# EAGLE design TeslaBMS_Shield_5 (EAGLE 6.6.0)
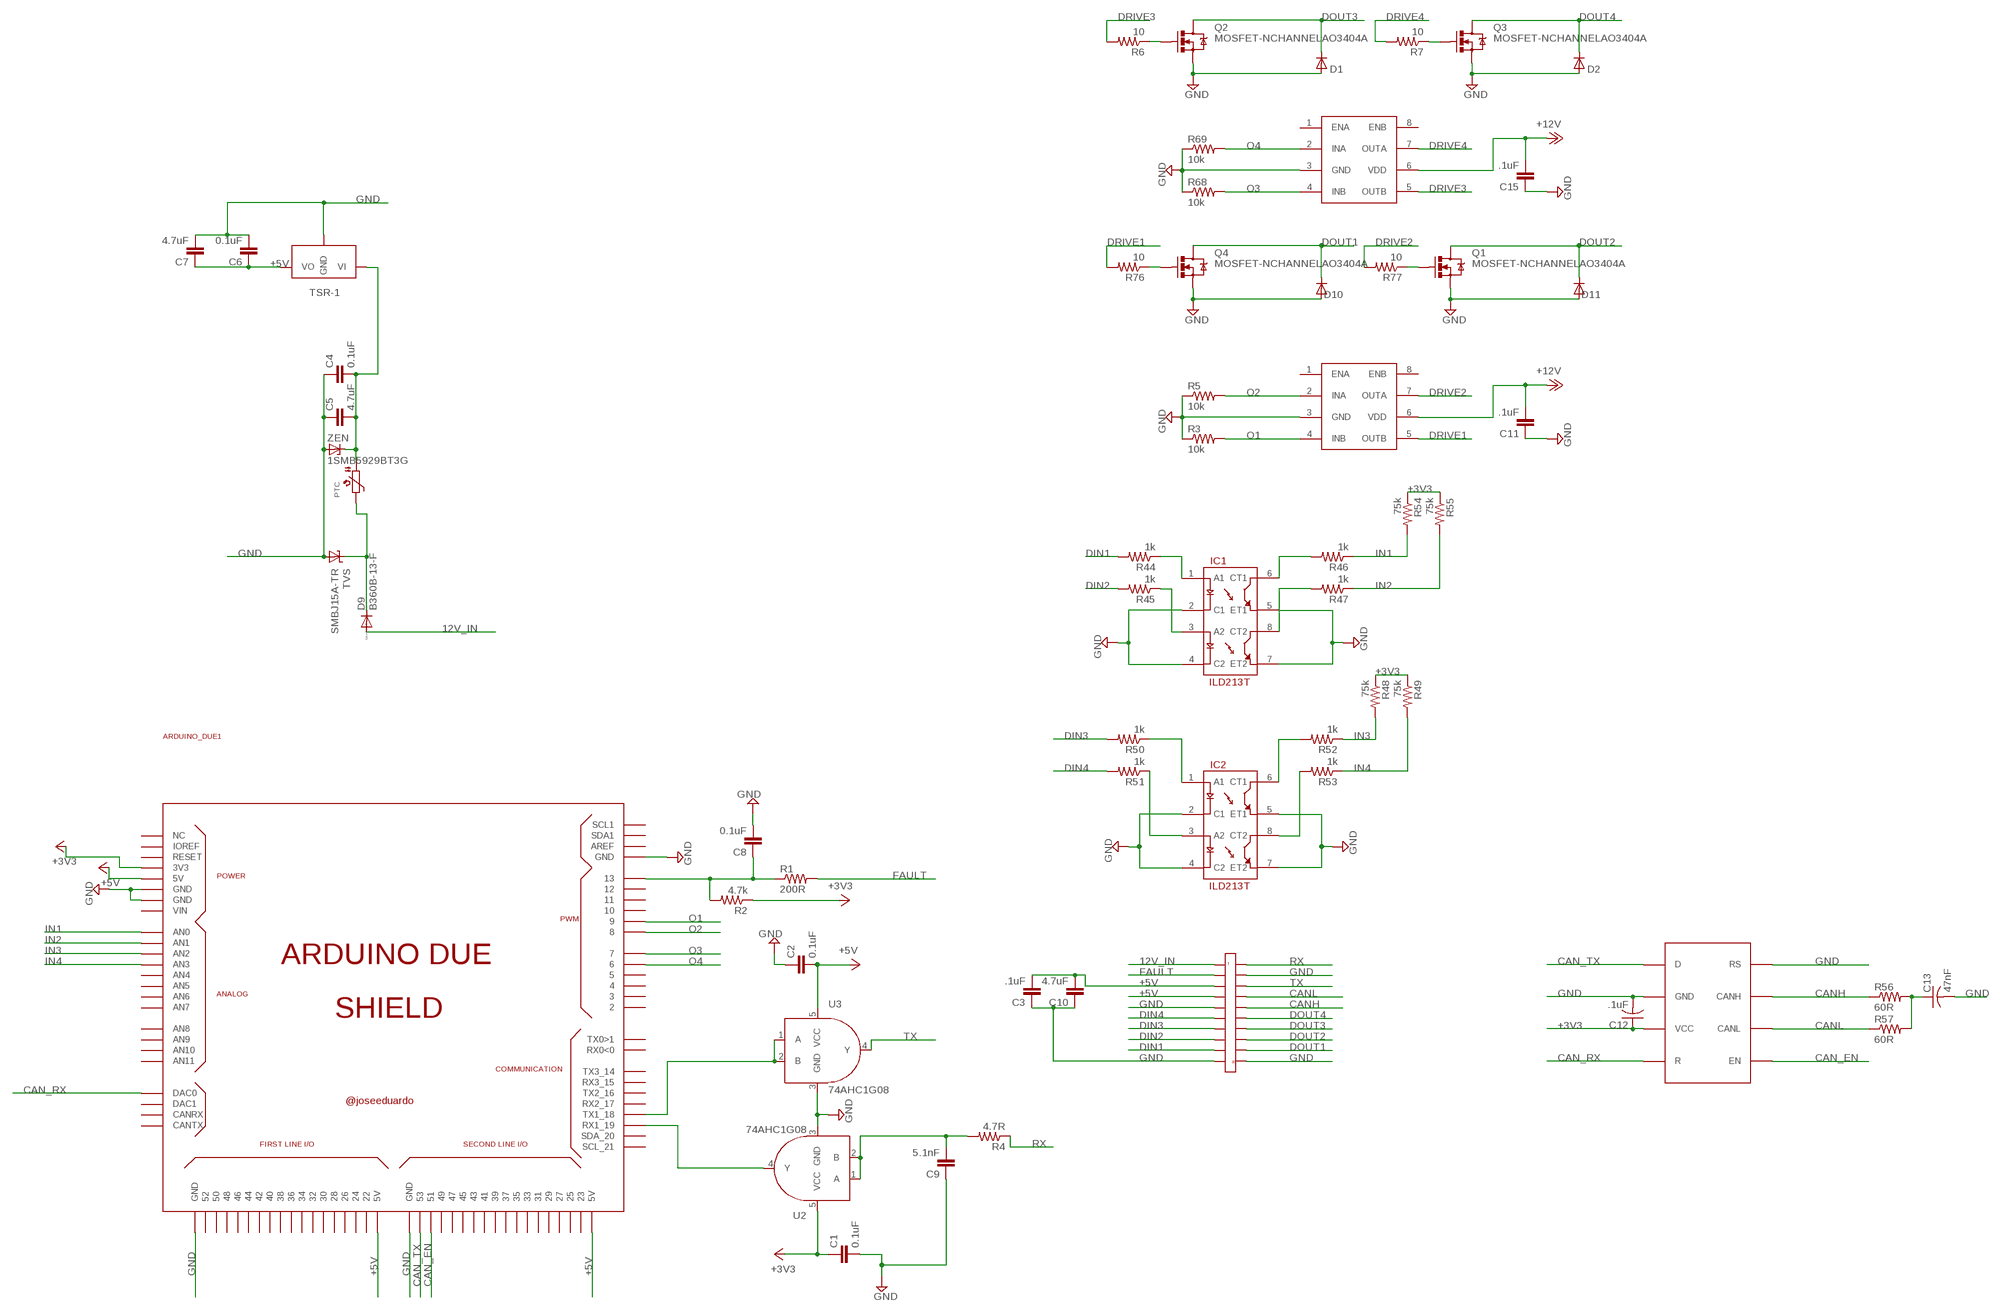
[diagram p0: schematic, sheet 1]

## Parts
ARDUINO_DUE1  ARDUINO_DUE_SHIELD  [ARDUINO_DUE_SHIELD]
C1  0.1uF  CAP0603-CAP  [0603-CAP]
C2  0.1uF  CAP0603-CAP  [0603-CAP]
C3  .1uF  CAP0603-CAP  [0603-CAP]
C4  0.1uF  CAP0805  [0805]
C5  4.7uF  CAP0805  [0805]
C6  0.1uF  CAP0805  [0805]
C7  4.7uF  CAP0805  [0805]
C8  0.1uF  CAP0603-CAP  [0603-CAP]
C9  5.1nF  CAP0603-CAP  [0603-CAP]
C10  4.7uF  CAP0603-CAP  [0603-CAP]
C11  .1uF  CAP0603-CAP  [0603-CAP]
C12  .1uF  C-USC0603  [C0603]
C13  47nF  C-USC0805  [C0805]
C15  .1uF  CAP0603-CAP  [0603-CAP]
D1  MBR0520LT  [SOD123]
D2  MBR0520LT  [SOD123]
D9  B360B-13-F  DIODE-SMB  [SMB]
D10  MBR0520LT  [SOD123]
D11  MBR0520LT  [SOD123]
IC1  ILD213T  [SO08]
IC2  ILD213T  [SO08]
PTC  PTC1812  [PTC1812]
Q1  MOSFET-NCHANNELAO3404A  [SOT23-3]
Q2  MOSFET-NCHANNELAO3404A  [SOT23-3]
Q3  MOSFET-NCHANNELAO3404A  [SOT23-3]
Q4  MOSFET-NCHANNELAO3404A  [SOT23-3]
R1  200R  RESISTOR0603-RES  [0603-RES]
R2  4.7k  RESISTOR0603-RES  [0603-RES]
R3  10k  R-US_R0402  [R0402]
R4  4.7R  RESISTOR0603-RES  [0603-RES]
R5  10k  R-US_R0402  [R0402]
R6  10  R-US_R0402  [R0402]
R7  10  R-US_R0402  [R0402]
R44  1k  RESISTOR0603-RES  [0603-RES]
R45  1k  RESISTOR0603-RES  [0603-RES]
R46  1k  RESISTOR0603-RES  [0603-RES]
R47  1k  RESISTOR0603-RES  [0603-RES]
R48  75k  RESISTOR0603-RES  [0603-RES]
R49  75k  RESISTOR0603-RES  [0603-RES]
R50  1k  RESISTOR0603-RES  [0603-RES]
R51  1k  RESISTOR0603-RES  [0603-RES]
R52  1k  RESISTOR0603-RES  [0603-RES]
R53  1k  RESISTOR0603-RES  [0603-RES]
R54  75k  RESISTOR0603-RES  [0603-RES]
R55  75k  RESISTOR0603-RES  [0603-RES]
R56  60R  R-US_M0805  [M0805]
R57  60R  R-US_M0805  [M0805]
R68  10k  R-US_R0402  [R0402]
R69  10k  R-US_R0402  [R0402]
R76  10  R-US_R0402  [R0402]
R77  10  R-US_R0402  [R0402]
TVS  SMBJ15A-TR  SUPPRESSOR-SMBJ  [SMBJ]
U1  SN65HVD234  [SOIC8]
U2  74AHC1G08  [SOT353]
U3  74AHC1G08  [SOT353]
U4  FAN3227  [SOIC8]
U5  FAN3227  [SOIC8]
U9  TSR-1  [TSR-1]
U$2  VAL-U-LOK-20PIN  [VALULOK-20]
ZEN  1SMB5929BT3G  ZENER-DIODESMB  [SMB]

## Nets
12V_IN: D9.A U$2.P$1
+3V3: ARDUINO_DUE1.3V3 C1.1 C12.1 R2.1 R48.1 R49.1 R54.1 R55.1 U1.PIN3(VCC) U2.5(VCC)
+5V: ARDUINO_DUE1.5V0(5V) ARDUINO_DUE1.5V0_1(5V) ARDUINO_DUE1.5V0_2(5V) C2.2 C3.2 C6.1 C7.1 C10.2 U3.5(VCC) U9.P$3(VO) U$2.P$3 U$2.P$4
+12V: C4.2 C5.2 C11.2 C15.2 PTC.P$1 U4.6(VDD) U5.6(VDD) U9.P$1(VI) ZEN.C
CAN_EN: ARDUINO_DUE1.51 U1.PIN5(EN)
CAN_RX: ARDUINO_DUE1.DAC0 U1.PIN4(R)
CAN_TX: ARDUINO_DUE1.53 U1.PIN1(D)
CANH: R56.1 U1.PIN7(CANH) U$2.P$15
CANL: R57.1 U1.PIN6(CANL) U$2.P$14
DIN1: R44.2 U$2.P$9
DIN2: R45.2 U$2.P$8
DIN3: R50.2 U$2.P$7
DIN4: R51.2 U$2.P$6
DOUT1: D10.C Q4.3(D) U$2.P$19
DOUT2: D11.C Q1.3(D) U$2.P$18
DOUT3: D1.C Q2.3(D) U$2.P$17
DOUT4: D2.C Q3.3(D) U$2.P$16
DRIVE1: R76.2 U5.5(OUTB)
DRIVE2: R77.2 U5.7(OUTA)
DRIVE3: R6.2 U4.5(OUTB)
DRIVE4: R7.2 U4.7(OUTA)
FAULT: R1.2 U$2.P$2
GND: ARDUINO_DUE1.GND ARDUINO_DUE1.GND_1(GND) ARDUINO_DUE1.GND_2(GND) ARDUINO_DUE1.GND_3(GND) ARDUINO_DUE1.GND_4(GND) C1.2 C2.1 C3.1 C4.1 C5.1 C6.2 C7.2 C8.2 C9.1 C10.1 C11.1 C12.2 C13.2 C15.1 D1.A D2.A D10.A D11.A IC1.2(C1) IC1.4(C2) IC1.5(ET1) IC1.7(ET2) IC2.2(C1) IC2.4(C2) IC2.5(ET1) IC2.7(ET2) Q1.2(S) Q2.2(S) Q3.2(S) Q4.2(S) R3.1 R5.1 R68.1 R69.1 TVS.A U1.PIN2(GND) U1.PIN8(RS) U2.3(GND) U3.3(GND) U4.3(GND) U5.3(GND) U9.P$2(GND) U$2.P$5 U$2.P$10 U$2.P$12 U$2.P$20 ZEN.A
IN1: ARDUINO_DUE1.A0(AN0) R46.1 R54.2
IN2: ARDUINO_DUE1.A1(AN1) R47.1 R55.2
IN3: ARDUINO_DUE1.A2(AN2) R48.2 R52.1
IN4: ARDUINO_DUE1.A3(AN3) R49.2 R53.1
N$1: D9.C PTC.P$2 TVS.C
N$2: ARDUINO_DUE1.19(RX1_19) U2.4(Y)
N$3: ARDUINO_DUE1.18(TX1_18) U3.1(A) U3.2(B)
N$4: Q4.1(G) R76.1
N$5: Q2.1(G) R6.1
N$6: IC1.3(A2) R45.1
N$7: ARDUINO_DUE1.13 C8.1 R1.1 R2.2
N$8: Q3.1(G) R7.1
N$9: C9.2 R4.2 U2.1(A) U2.2(B)
N$10: Q1.1(G) R77.1
N$31: IC1.1(A1) R44.1
N$32: IC2.6(CT1) R52.2
N$33: C13.1 R56.2 R57.2
N$36: IC2.8(CT2) R53.2
N$37: IC1.6(CT1) R46.2
N$38: IC1.8(CT2) R47.2
N$41: IC2.1(A1) R50.1
N$42: IC2.3(A2) R51.1
O1: ARDUINO_DUE1.9 R3.2 U5.4(INB)
O2: ARDUINO_DUE1.8 R5.2 U5.2(INA)
O3: ARDUINO_DUE1.7 R68.2 U4.4(INB)
O4: ARDUINO_DUE1.6 R69.2 U4.2(INA)
RX: R4.1 U$2.P$11
TX: U3.4(Y) U$2.P$13
Unconnected: ARDUINO_DUE1.0(RX0<0) ARDUINO_DUE1.1(TX0>1) ARDUINO_DUE1.2 ARDUINO_DUE1.3 ARDUINO_DUE1.4 ARDUINO_DUE1.5 ARDUINO_DUE1.10 ARDUINO_DUE1.11 ARDUINO_DUE1.12 ARDUINO_DUE1.14(TX3_14) ARDUINO_DUE1.15(RX3_15) ARDUINO_DUE1.16(TX2_16) ARDUINO_DUE1.17(RX2_17) ARDUINO_DUE1.20(SDA_20) ARDUINO_DUE1.21(SCL_21) ARDUINO_DUE1.22 ARDUINO_DUE1.23 ARDUINO_DUE1.24 ARDUINO_DUE1.25 ARDUINO_DUE1.26 ARDUINO_DUE1.27 ARDUINO_DUE1.28 ARDUINO_DUE1.29 ARDUINO_DUE1.30 ARDUINO_DUE1.31 ARDUINO_DUE1.32 ARDUINO_DUE1.33 ARDUINO_DUE1.34 ARDUINO_DUE1.35 ARDUINO_DUE1.36 ARDUINO_DUE1.37 ARDUINO_DUE1.38 ARDUINO_DUE1.39 ARDUINO_DUE1.40 ARDUINO_DUE1.41 ARDUINO_DUE1.42 ARDUINO_DUE1.43 ARDUINO_DUE1.44 ARDUINO_DUE1.45 ARDUINO_DUE1.46 ARDUINO_DUE1.47 ARDUINO_DUE1.48 ARDUINO_DUE1.49 ARDUINO_DUE1.50 ARDUINO_DUE1.52 ARDUINO_DUE1.A4(AN4) ARDUINO_DUE1.A5(AN5) ARDUINO_DUE1.A6(AN6) ARDUINO_DUE1.A7(AN7) ARDUINO_DUE1.A8(AN8) ARDUINO_DUE1.A9(AN9) ARDUINO_DUE1.A10(AN10) ARDUINO_DUE1.A11(AN11) ARDUINO_DUE1.AREF ARDUINO_DUE1.CANRX ARDUINO_DUE1.CANTX ARDUINO_DUE1.DAC1 ARDUINO_DUE1.IOREF ARDUINO_DUE1.NC_2(NC) ARDUINO_DUE1.RESET ARDUINO_DUE1.SCL1 ARDUINO_DUE1.SDA1 ARDUINO_DUE1.VIN U4.1(ENA) U4.8(ENB) U5.1(ENA) U5.8(ENB)

## Library data of the parts
ARDUINO_DUE1 = arduino_due_shield:ARDUINO_DUE_SHIELD
C1-C11 C15 = SparkFun-Passives:CAP: Capacitor Standard 0603 ceramic capacitor, and 0.1" leaded capacitor.
C12 C13 = rcl:C-US: CAPACITOR, American symbol
D1 D2 D10 D11 = diode:MBR0520LT: SCHOTTKY BARRIER RECTIFIER Source: http://onsemi.com .. MBR0520LT1-D.pdf
D9 = diode:DIODE-: DIODE
IC1 IC2 = SparkFun-DiscreteSemi:ILD213T: Dual optoisolator.
PTC = microbuilder:PTC: PTC (Resettable Fuse) 1206 Package 250mA PTC (16V Max, Time-to-Trip: 0.08s) - Digikey: F2110CT-ND 1210 Package 100mA PTC (30V Max, Time-to-Trip: 0.6s) - Digikey: MF-USMF010-2CT-ND 1812 Package 750mA PTC (24V Max, Time-to-Trip: 0.2s) - Digikey: MF-MSMF075/24-2CT-ND
Q1-Q4 = SparkFun-DiscreteSemi:MOSFET-NCHANNEL: Common NMOSFET Parts MFG P/N Store ID Prod ID FDD8780 TRANS-09984 SI7820DN TRANS-11055 FDS6630A IC-08089 2N7002PW TRANS-11151 FQP30N06L COM-10213 TRANS-10060 BSS123LT1G TRANS-08345 BSS138 TRANS-00830 BS170 2N7000; PROD_ID: TRAN-12988
R1 R2 R4 R44-R55 = SparkFun-Passives:RESISTOR: Resistor Basic schematic elements and footprints for 0603, 1206, and PTH resistors.
R3 R5-R7 R56 R57 R68 R69 R76 R77 = rcl:R-US_: RESISTOR, American symbol
TVS = diode:SUPPRESSOR-: Suppressor diode
U1 = ck_custom:SN65HVD234
U2 U3 = SparkFun-DigitalIC:74AHC1G08: Single 2-input AND gate; PROD_ID: IC-10841
U4 U5 = collin:FAN3227
U9 = Traco:TSR-1
U$2 = ck_custom:VAL-U-LOK-20PIN
ZEN = diode:ZENER-DIODE: Z-Diode

## Net classes
0 default: width 0.203 mm, drill 0.305 mm, clearance 0.203 mm

## Board
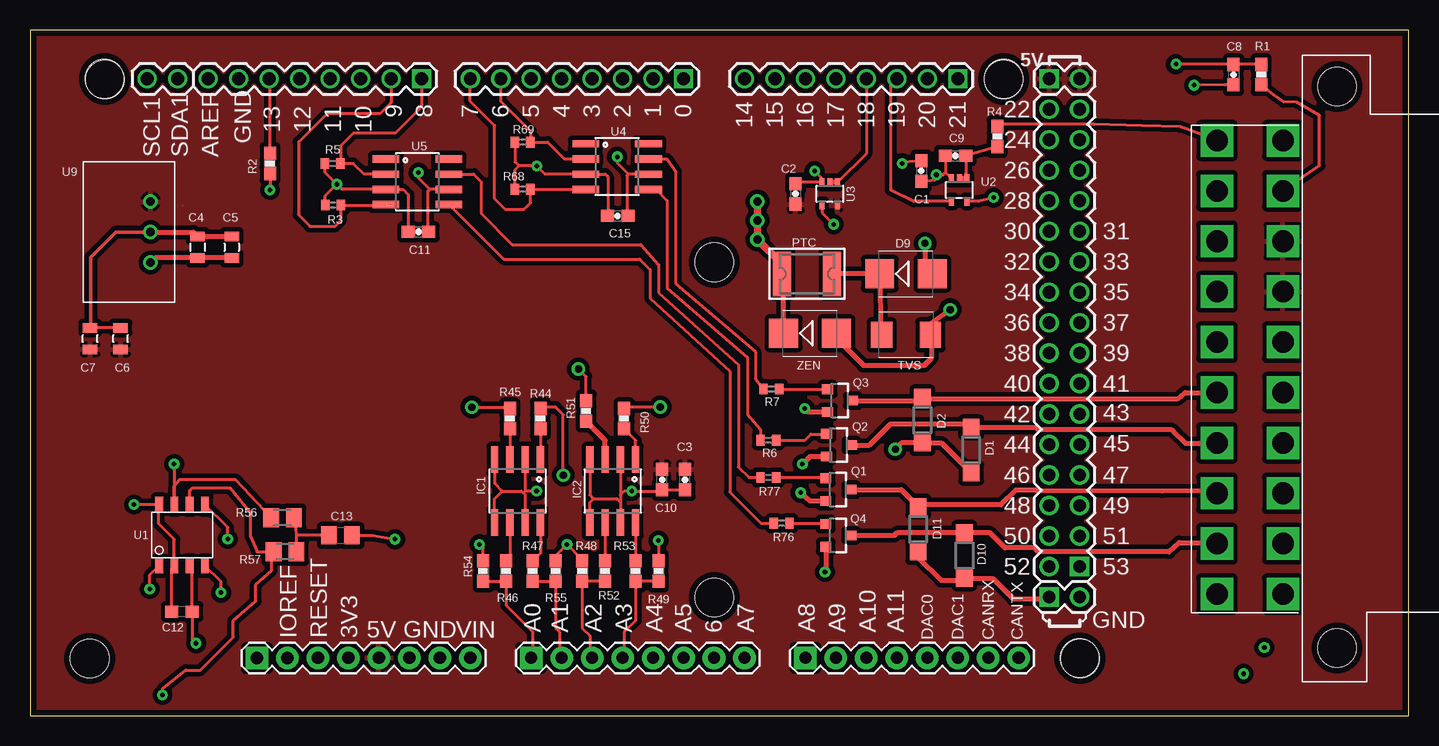
[diagram p1: board, top side]
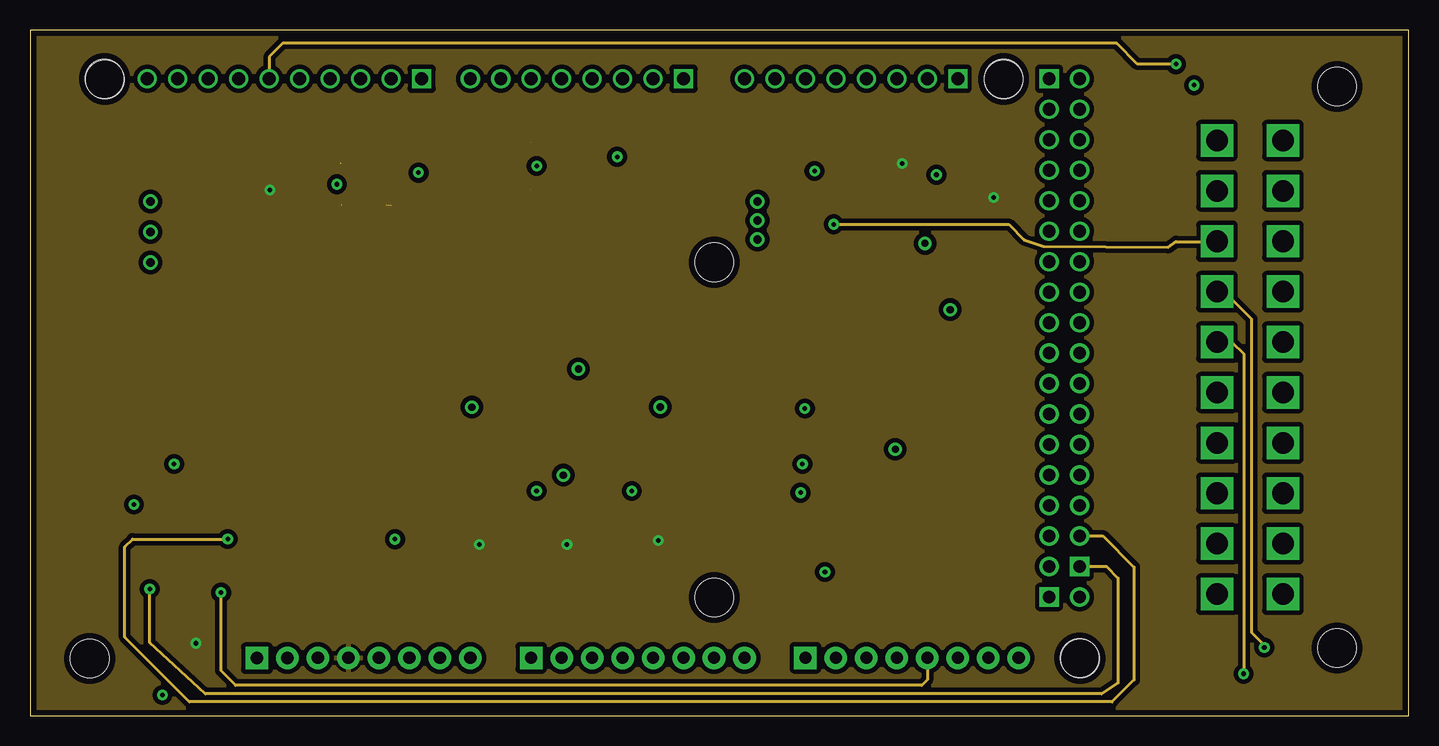
[diagram p2: board, inner layer Route2]
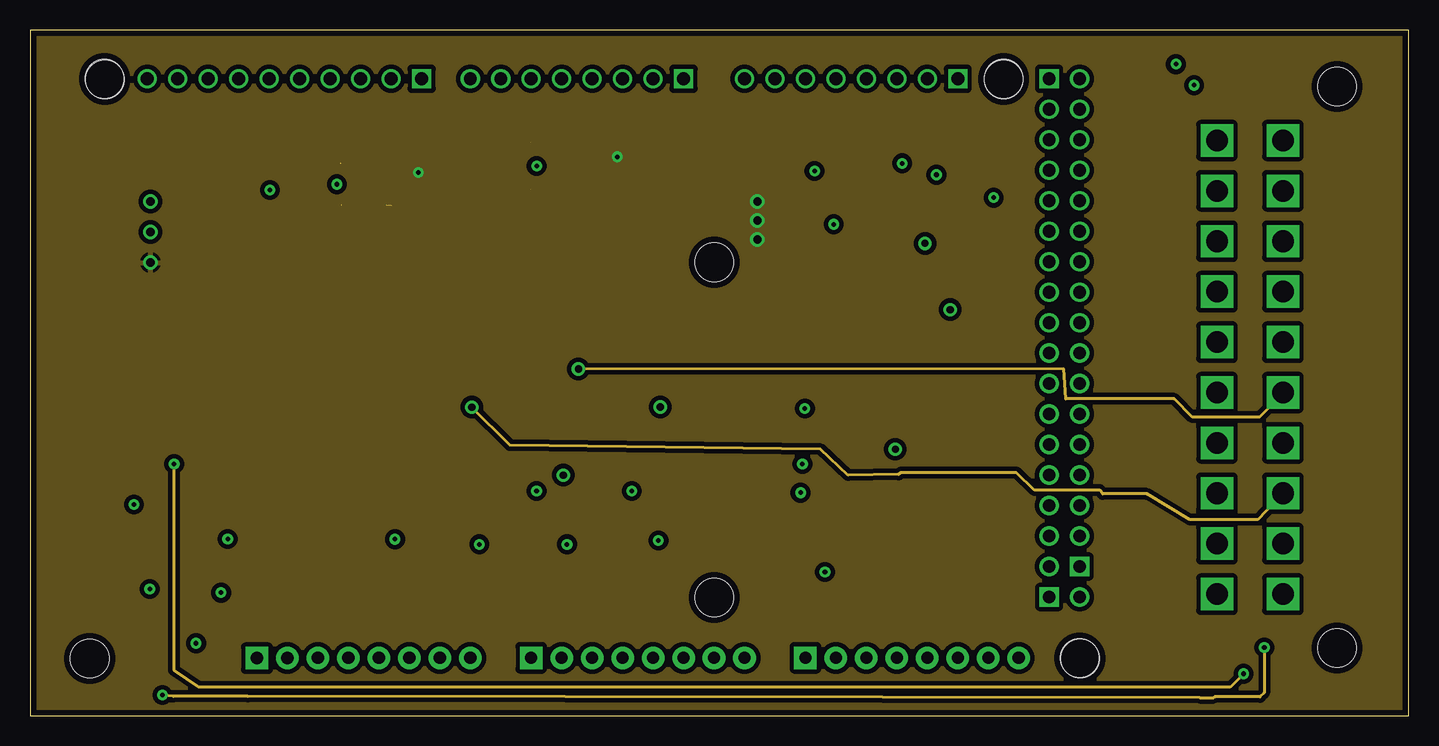
[diagram p3: board, inner layer Route15]
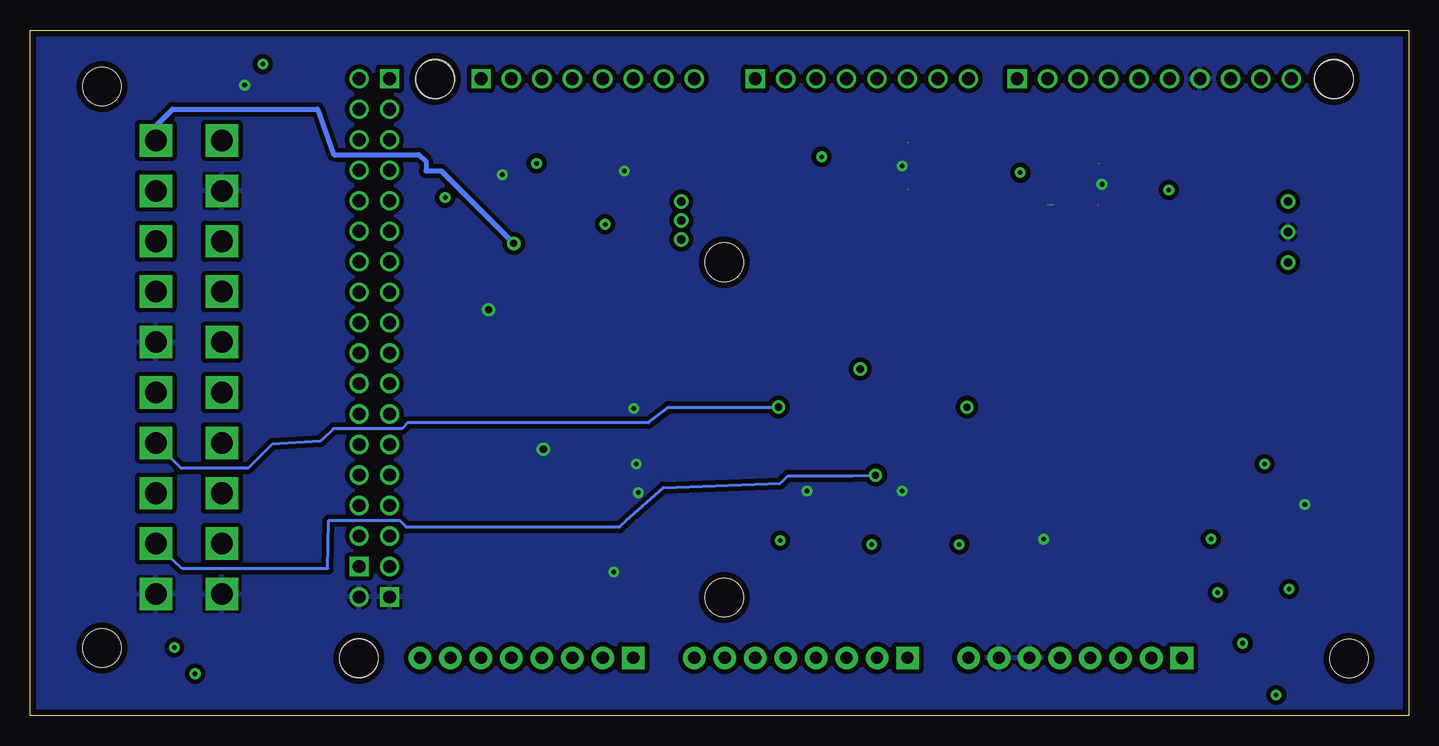
[diagram p4: board, bottom side, seen from below]

Size 114.94 x 57.15 mm. Coordinates in mm from the lower left corner, seen from the top.
Outline: 0,0 114.94,0 114.94,57.15 0,57.15 0,0
Copper layers (1+2*15+16): Top 0.0178mm / dielectric 12mil / Route2 0.0356mm / dielectric 28mil / Route15 0.0356mm / dielectric 12mil / Bottom 0.0178mm
Design rules "SSC-EAGLE-4Lyr_v1.0.0.3 *": minimum track width 6mil, minimum drill 8mil, track to track 15mil, track to pad 15mil, pad to pad 15mil, via to via 15mil, smd to smd 6mil, copper to edge 20mil, drill to drill 16mil, minimum pad ring 10mil, minimum via ring 10mil, stop-mask expansion 10mil, vias tented up to drill 0mil, thermal gap 10mil

### Footprints (pad centres in the part's own frame; a part is rotated, then mirrored left to right if it is on the bottom)
ARDUINO_DUE_SHIELD = drill 1.067 square: 0 63.373,51.816; 5V0_1 93.853,51.816; 8 41.529,51.816; 21 86.233,51.816; 53 96.393,11.176; GND_2 93.853,8.636 | drill 1.067: 1 60.833,51.816; 2 58.293,51.816; 3 55.753,51.816; 4 53.213,51.816; 5 50.673,51.816; 5V0_2 96.393,51.816; 6 48.133,51.816; 7 45.593,51.816; 9 38.989,51.816; 10 36.449,51.816; 11 33.909,51.816; 12 31.369,51.816; 13 28.829,51.816; 14 68.453,51.816; 15 70.993,51.816; 16 73.533,51.816; 17 76.073,51.816; 18 78.613,51.816; 19 81.153,51.816; 20 83.693,51.816; 22 93.853,49.276; 23 96.393,49.276; 24 93.853,46.736; 25 96.393,46.736; 26 93.853,44.196; 27 96.393,44.196; 28 93.853,41.656; 29 96.393,41.656; 30 93.853,39.116; 31 96.393,39.116; 32 93.853,36.576; 33 96.393,36.576; 34 93.853,34.036; 35 96.393,34.036; 36 93.853,31.496; 37 96.393,31.496; 38 93.853,28.956; 39 96.393,28.956; 40 93.853,26.416; 41 96.393,26.416; 42 93.853,23.876; 43 96.393,23.876; 44 93.853,21.336; 45 96.393,21.336; 46 93.853,18.796; 47 96.393,18.796; 48 93.853,16.256; 49 96.393,16.256; 50 93.853,13.716; 51 96.393,13.716; 52 93.853,11.176; AREF 23.749,51.816; GND_3 96.393,8.636; GND_4 26.289,51.816; SCL1 18.669,51.816; SDA1 21.209,51.816 | drill 1.016 pad 1.88: 3V3 35.433,3.556; 5V0 37.973,3.556; A1 53.213,3.556; A2 55.753,3.556; A3 58.293,3.556; A4 60.833,3.556; A5 63.373,3.556; A6 65.913,3.556; A7 68.453,3.556; A9 76.073,3.556; A10 78.613,3.556; A11 81.153,3.556; CANRX 88.773,3.556; CANTX 91.313,3.556; DAC0 83.693,3.556; DAC1 86.233,3.556; GND 40.513,3.556; GND_1 43.053,3.556; IOREF 30.346,3.543; RESET 32.893,3.555; VIN 45.593,3.556 | drill 1.016 pad 1.88 square: A0 50.673,3.556; A8 73.533,3.556; NC_2 27.806,3.543 | hole 3.2: 15.113,51.816; 90.043,51.816; 96.393,3.556; 96.418,3.505; 15.138,51.765; 90.068,51.765; 13.868,3.505; 65.938,36.525; 65.938,8.585
0603-CAP = smd 1.1 x 1: 1 -0.85,0; 2 0.85,0
0805 = smd 0.8 x 1.2: 1 -0.9,0; 2 0.9,0
C0603 = smd 1.1 x 1: 1 -0.85,0; 2 0.85,0
C0805 = smd 1.3 x 1.5: 1 -0.95,0; 2 0.95,0
SOD123 = smd 1.4 x 1.4: A 1.9,0; C -1.9,0
SMB = smd 2.4 x 2.4: A 2.2,0; C -2.2,0
SO08 = smd 0.61 x 2.21: 1 -1.905,-2.616; 2 -0.635,-2.616; 3 0.635,-2.616; 4 1.905,-2.616; 5 1.905,2.616; 6 0.635,2.616; 7 -0.635,2.616; 8 -1.905,2.616
PTC1812 = smd 1.5 x 3.7: P$1 -2.1,0; P$2 2.1,0
SOT23-3 = smd 0.8 x 0.9: 1 -0.95,-1; 2 0.95,-1; 3 0,1.1
0603-RES = smd 1.1 x 1: 1 -0.85,0; 2 0.85,0
R0402 = smd 0.7 x 0.9: 1 -0.65,0; 2 0.65,0
M0805 = smd 1.3 x 1.6: 1 -0.95,0; 2 0.95,0
SMBJ = smd 1.78 x 2.16: A 2.04,0; C -2.03,0
SOIC8 = smd 0.635 x 1.27: PIN1 0.635,-0.635; PIN2 1.905,-0.635; PIN3 3.175,-0.635; PIN4 4.445,-0.635; PIN5 4.445,4.445; PIN6 3.175,4.445; PIN7 1.905,4.445; PIN8 0.635,4.445
SOT353 = smd 0.42 x 0.7: 1 -0.65,-0.95; 2 0,-0.95; 3 0.65,-0.95; 4 0.65,0.95; 5 -0.65,0.95
SOIC8' = smd 0.61 x 2.21: 1 0.635,-0.076; 2 1.905,-0.076; 3 3.175,-0.076; 4 4.445,-0.076; 5 4.445,5.156; 6 3.175,5.156; 7 1.905,5.156; 8 0.635,5.156
TSR-1 = drill 0.7: P$1 -2.55,-1.8; P$2 -0.01,-1.8; P$3 2.53,-1.8
VALULOK-20 = drill 1.8 square: P$1 0,0; P$2 0,4.2; P$3 0,8.4; P$4 0,12.6; P$5 0,16.8; P$6 0,21; P$7 0,25.2; P$8 0,29.4; P$9 0,33.6; P$10 0,37.8; P$11 5.5,0; P$12 5.5,4.2; P$13 5.5,8.4; P$14 5.5,12.6; P$15 5.5,16.8; P$16 5.5,21; P$17 5.5,25.2; P$18 5.5,29.4; P$19 5.5,33.6; P$20 5.5,37.8 | hole 3.2: -4.5,-4.5; -4.5,42.3

### Placement (x,y rotation side)
ARDUINO_DUE1  -8.89,1.27 0 top
C1  74.3,45.4 270 top
C2  63.82,43.5 270 top
C3  54.61,19.68 90 top
C4  13.97,39.05 270 top
C5  16.83,39.05 270 top
C6  7.56,31.43 90 top
C7  5.02,31.43 90 top
C8  100.33,53.43 270 top
C9  77.15,46.67 0 top
C10  52.7,19.68 90 top
C11  32.38,40.34 0 top
C12  12.67,8.69 180 top
C13  25.88,15.04 0 top
C15  49,41.66 0 top
D1  78.46,22.15 270 top
D2  74.4,24.64 270 top
D9  73.03,36.83 0 top
D10  77.9,13.36 270 top
D11  74.04,15.54 270 top
IC1  40.64,18.73 180 top
IC2  48.58,18.73 180 top
PTC  64.77,36.83 0 top
Q1  67.34,18.85 270 top
Q2  67.39,22.56 270 top
Q3  67.49,26.26 270 top
Q4  67.34,15.04 270 top
R1  102.63,53.43 270 top
R2  20,46.04 90 top
R3  25.27,42.57 0 top
R4  80.65,48.26 270 top
R5  25.22,46.02 0 top
R6  61.54,22.96 180 top
R7  61.8,27.23 180 top
R44  42.54,24.77 90 top
R45  40,24.77 90 top
R46  39.69,12.07 90 top
R47  41.91,12.07 90 top
R48  46.04,12.07 270 top
R49  52.39,12.07 270 top
R50  49.53,24.77 90 top
R51  46.35,25.4 90 top
R52  47.94,12.07 90 top
R53  50.48,12.07 90 top
R54  37.78,12.07 270 top
R55  43.81,12.07 270 top
R56  21.06,16.51 0 top
R57  21.26,13.67 0 top
R68  41.07,43.89 0 top
R69  41.07,47.8 0 top
R76  62.66,16.05 180 top
R77  61.54,19.86 180 top
TVS  73.03,31.75 0 top
U1  10.13,13.16 0 top
U2  77.47,43.81 180 top
U3  66.68,43.5 180 top
U4  FAN3227  [SOIC8']  46.41,48.31 270 top
U5  FAN3227  [SOIC8']  29.74,47.04 270 top
U9  8.25,40.32 90 top
U$2  104.44,47.94 180 top
ZEN  65.02,31.88 0 top

### Tracks (layer width: path | path; a pad name or v marks a point on that pad's centre or on a via)
12V_IN  (via drill 0.6)
  Top 0.406: v74.61,39.37 74.61,36.85 D9.A
  Bottom 0.406: v74.61,39.37 80.65,45.4 81.92,45.4 81.92,46.23 82.5,46.76 89.61,46.76 90.96,50.55 103.05,50.55 104.45,49.15 U$2.P$1
+3V3  (via drill 0.38)
  Top 0.254: v52.39,14.61 R49.1 | R55.1 43.81,13.34 v44.77,14.29 46.04,13.02 R48.1 | R54.1 37.78,13.97 v37.46,14.29 | R2.1 v20,43.81 | v80.33,43.18 79.07,42.86 U2.5 | C1.1 72.81,46.14 v72.71,46.04 | U1.PIN3 13.52,12.31 C12.1 13.52,6.36 v13.84,6.04
  pour Route2: 0.13,57.15 114.94,57.15 114.94,0 0,0
+5V
  pour Top: 0.13,57.15 114.94,57.15 114.94,0 0,0
+12V  (via drill 0.38, 0.7)
  Top 0.254: U4.6 49.89,45.14 | 49.89,45.14 49.76,45.01 49.76,41.74 C15.2 | U5.6 33.32,43.87 | 33.32,43.87 33.15,43.69 33.15,40.42 C11.2 | v32.38,45.26 32.38,44.81 33.32,43.87 | v48.95,46.58 48.95,46.08 49.89,45.14
  Top 0.406: C5.2 C4.2 10.43,38.15 U9.P$1 | ZEN.C 62.82,36.68 PTC.P$1
  Top 0.61: PTC.P$1 62.67,37.66 v60.64,39.69 v60.64,42.86
  other vias: 60.64,41.27
  pour Route15: 0.13,57.15 114.94,57.15 114.94,0 0,0
CAN_EN  (via drill 0.38)
  Top 0.254: v16.48,14.73 16.48,15.7 U1.PIN5
  Route2 0.254: ARDUINO_DUE1.51 89.43,14.99 92.02,12.39 92.02,3 90.2,1.17 13.28,1.17 7.9,6.55 7.9,14.07 8.56,14.73 v16.48,14.73
CAN_RX  (via drill 0.38)
  Top 0.254: v15.93,10.26 15.93,11.18 U1.PIN4
  Route2 0.254: ARDUINO_DUE1.DAC0 74.8,3 74.35,2.54 17.14,2.54 15.93,3.76 v15.93,10.26
CAN_TX  (via drill 0.38)
  Top 0.254: v9.98,10.57 9.98,11.73 U1.PIN1
  Route2 0.254: ARDUINO_DUE1.53 89.74,12.45 90.7,11.48 90.7,2.74 89.33,1.83 14.6,1.83 9.98,6.1 v9.98,10.57
CANH  (via drill 0.38)
  Top 0.254: R56.1 17.11,19.71 12.47,19.71 12.04,19.18 U1.PIN7 12.01,17.63 v12.01,20.98
  Route2 0.254: U$2.P$15 100.2,31.14 101.17,30.18 v101.17,3.5
  Route15 0.254: v12.01,20.98 12.01,3.81 14.1,2.39 100.05,2.39 v101.17,3.5
CANL  (via drill 0.38)
  Top 0.254: U1.PIN6 13.31,18.77 13.54,19 16.69,19 18.36,16.97 18.36,14.99 18.92,13.66 R57.1 20.14,13.45 20.14,12.09 18.82,10.92 18.82,9.55 16.94,7.92 16.94,6.55 14.2,3.81 12.98,3.81 11.05,2.23 v11.05,1.73
  Route2 0.254: U$2.P$14 98.96,35.36 99.54,35.36 101.83,33.07 101.83,6.96 102.9,5.89 v102.9,5.69
  Route15 0.254: v11.05,1.73 11.96,1.63 18.16,1.63 97.51,1.52 98.68,1.52 98.73,1.58 102.54,1.58 102.9,1.93 v102.9,5.69
DIN1  (via drill 0.6)
  Top 0.254: v44.45,20.05 44.45,25.08 43.81,25.72 42.65,25.72 R44.2
  Bottom 0.254: v44.45,20.05 46.35,20 51.75,20 52.39,19.37 62.13,19.01 65.25,16.24 65.27,16.24 65.81,15.7 83.54,15.7 84.1,16.26 90.03,16.26 90.04,16.24 90.1,12.26 102.26,12.26 U$2.P$9
DIN2  (via drill 0.6)
  Top 0.254: v36.83,25.72 39.9,25.72 R45.2
  Route15 0.254: U$2.P$8 102.34,16.36 96.7,16.36 93.09,18.49 89.43,18.49 89.18,18.8 83.74,18.8 82.22,20.27 72.62,20.27 72.42,20.12 68.2,20.07 65.91,22.2 40,22.55 v36.83,25.72
DIN3  (via drill 0.6)
  Top 0.254: v52.54,25.73 49.64,25.73
  Top 0.406: 49.64,25.73 R50.2
  Bottom 0.254: v52.54,25.73 61.72,25.73 63.4,24.41 83.46,24.41 83.9,23.93 89.62,23.93 90.71,22.89 94.73,22.64 96.75,20.62 102.33,20.62 U$2.P$7
DIN4  (via drill 0.6)
  Top 0.254: R51.2 46.35,28.26 v45.72,28.89
  Route15 0.254: U$2.P$6 104.45,26.85 102.49,24.89 96.9,24.89 95.38,26.42 86.34,26.42 86.18,28.9 v45.72,28.89
DOUT1
  Top 0.406: 94.97,13.72 95.78,14.43 98.86,14.43 U$2.P$19 | 94.97,13.72 84,13.72 83.73,13.99 81.29,13.99 80.04,15.24 77.92,15.24 D10.C 77.87,15.29 72.31,15.29 72.06,15.04 Q4.3 | 94.97,13.66 94.97,13.72
DOUT2
  Top 0.406: 98.89,18.49 U$2.P$18 98.69,18.8 94.36,18.74 83.84,18.8 82.17,18.8 80.95,17.58 74.17,17.58 D11.C 72.64,18.85 Q1.3
DOUT3
  Top 0.406: U$2.P$17 98.91,22.71 96.34,22.71 95.29,23.76 95.12,23.88 84,23.88 83.91,24.01 78.5,24.01 D1.C 78.18,24.33 71.76,24.33 69.98,22.55 Q2.3
DOUT4
  Top 0.406: U$2.P$16 98.93,26.92 96.29,26.92 95.7,26.43 95.41,26.42 74.52,26.42 D2.C 74.12,26.26 Q3.3
DRIVE1
  Top 0.254: U5.5 34.95,42.6 39.5,38.05 50.82,38.05 51.69,37.19 51.69,34.8 58.34,28.7 58.34,18.64 60.93,16.05 R76.2
DRIVE2
  Top 0.254: U5.7 36.98,45.14 37.62,44.5 37.62,41.86 40.21,39.27 50.93,39.27 52.4,37.59 52.4,35.26 59.05,29.26 59.05,20.73 59.92,19.86 R77.2
DRIVE3
  Top 0.254: U4.5 52.17,43.87 53.11,42.93 53.11,35.61 59.82,29.82 59.82,25.15 60.88,23.88 60.88,22.97 R6.2
DRIVE4
  Top 0.254: U4.7 53.09,46.41 53.82,45.36 53.82,36.02 60.48,30.33 60.48,28.1 R7.2 61.1,27.28
FAULT
  Top 0.254: U$2.P$2 107.49,45.85 107.49,50.04 105.59,51.12 104.51,51.16 103.67,51.77 R1.2
GND  (via drill 0.38, 0.6)
  Top 0.254: IC2.5 46.67,17.78 46.99,18.1 | 46.99,18.1 48.89,18.1 49.21,17.78 | 49.21,17.78 IC2.7 | IC2.2 49.21,18.41 | 49.21,18.41 49.21,17.78 | IC2.4 46.67,18.41 46.99,18.1 | C8.2 99.61,52.58 v97.04,52.55 | C9.1 76.3,45.28 | 76.3,45.28 U2.3 | C1.2 75.46,44.66 v75.56,45.09 76.11,45.09 76.3,45.28 | C2.1 63.92,44.45 U3.3 66.03,44.78 v65.41,45.4 | IC1.5 38.73,18.1 39.37,18.73 | 39.37,18.73 40.96,18.73 41.12,18.57 | 41.12,18.57 41.27,18.41 IC1.7 | IC1.2 41.27,18.73 | 41.27,18.73 41.12,18.57 | IC1.4 38.73,19.37 39.37,18.73 | v42.23,18.73 41.27,18.73 | 49.21,18.41 49.53,18.73 v50.16,18.73 52.6,18.73 C10.1 C3.1 | C6.2 C7.2 | ZEN.A 67.22,31.45 | 75.18,31.63 TVS.A | C12.2 11.82,12.31 U1.PIN2 12.04,14.71 10.74,16 10.74,17.58 U1.PIN8 v8.67,17.6 v8.66,17.61 | C13.2 28.54,15.04 v30.43,14.72 | 40.77,45.82 v42.24,45.82 42.93,45.14 U4.3 47.95,45.14 48.18,44.91 48.18,41.69 C15.1 | 40.77,45.82 40.41,45.47 40.41,43.9 R68.1 | R69.1 40.42,46.17 40.77,45.82 | v25.58,44.3 26.01,43.87 U5.3 31.09,43.87 31.52,43.43 31.52,40.35 C11.1 | R5.1 24.57,45.3 v25.58,44.3 | R3.1 24.62,43.34 v25.58,44.3
  Top 0.305: U9.P$2 7.17,40.31 5.08,38.23 5.08,32.4 C7.2
  Top 0.406: U9.P$2 13.61,40.31 C4.1 C5.1 | TVS.A 74.43,32.2 v76.71,33.84 | 67.22,31.45 69.47,29.21 74.55,29.21 75.18,29.84 75.18,31.63 | D11.A 74.04,13.21 75.97,11.28 77.72,11.28 D10.A 80.26,11.46 81.97,9.75 84.81,9.75 ARDUINO_DUE1.GND_2 | D1.A 75.97,22.74 D2.A 72.66,22.74 v72.14,22.21 | Q4.2 66.34,12.06 v66.27,11.99 | Q3.2 64.88,25.31 v64.59,25.6 | Q1.2 65.03,17.9 v64.24,18.59 | Q2.2 65.01,21.61 v64.39,20.98
  pour Bottom: 0.13,57.15 114.94,57.15 114.94,0 0,0
IN1
  Top 0.254: R54.2 R46.1 39.69,9.21 41.91,6.99 41.91,4.95 ARDUINO_DUE1.A0
IN2
  Top 0.254: R47.1 R55.2 43.81,7.3 44.13,6.99 44.13,5.02 ARDUINO_DUE1.A1
IN3
  Top 0.254: R52.1 R48.2 46.04,7.3 46.67,6.67 46.67,5.02 ARDUINO_DUE1.A2
IN4
  Top 0.254: R49.2 R53.1 50.48,7.94 49.53,6.99 49.53,4.95 ARDUINO_DUE1.A3
N$1
  Top 0.406: D9.C 70.48,36.83 | D9.C PTC.P$2 | D9.C 70.95,31.92 TVS.C
N$2
  Top 0.254: U2.4 73.66,42.87 71.76,43.81 71.76,52.58 ARDUINO_DUE1.19
N$3
  Top 0.254: ARDUINO_DUE1.18 69.72,46.85 U3.1
  Top 0.406: U3.1 U3.2
N$4
  Top 0.254: R76.1 66.27,16.05 Q4.1
N$5
  Top 0.254: R6.1 64.59,22.96 65.1,23.47 66.35,23.47 Q2.1
N$6
  Top 0.254: R45.1 IC1.3
N$7  (via drill 0.38)
  Top 0.254: R2.2 20,53.02 ARDUINO_DUE1.13 20,53.15 | R1.1 C8.1 95.56,54.28
  Top 0.406: 95.56,54.28 v95.53,54.3
  Route2 0.254: v95.53,54.3 92.33,54.3 90.6,56.03 21.06,56.03 19.94,54.91 ARDUINO_DUE1.13
N$8
  Top 0.254: R7.1 66.47,27.23 Q3.1
N$9
  Top 0.254: R4.2 C9.2 78,45.2 U2.1
  Top 0.406: U2.1 U2.2
N$10
  Top 0.254: R77.1 66.27,19.86 Q1.1
N$31
  Top 0.254: R44.1 IC1.1
N$32
  Top 0.254: IC2.6 R52.2
N$33
  Top 0.254: R57.2 22.21,15.04 | 22.21,15.04 22.16,16.2 R56.2 | C13.1 22.21,15.04
N$36
  Top 0.254: IC2.8 R53.2
N$37
  Top 0.254: IC1.6 40,13.23 R46.2
N$38
  Top 0.254: IC1.8 42.54,13.55 R47.2
N$41
  Top 0.254: IC2.1 50.48,22.96 R50.1
N$42
  Top 0.406: IC2.3 47.94,22.96 R51.1
O1  (2 unrouted)
  Top 0.254: ARDUINO_DUE1.9 30.1,51.1 29.19,50.19 24.77,50.19 22.38,47.8 22.38,41.76 23.34,40.79 25.43,40.79 25.93,41.3 R3.2 29.63,42.56 U5.4 | 30.14,42.56 30.2,42.62
O2  (1 unrouted)
  Top 0.254: U5.2 27.84,45.14 26.95,46.02 R5.2 | ARDUINO_DUE1.8 32.64,50.75 30.46,48.56 26.95,48.56 25.88,47.5 25.88,46.03
O3  (1 unrouted)
  Top 0.254: R68.2 46.3,43.89 U4.4 | R68.2 41.73,42.77 41.17,42.21 39.6,42.21 38.73,43.08 38.73,49.17 36.7,51.21 ARDUINO_DUE1.7
O4  (1 unrouted)
  Top 0.254: R69.2 43.15,47.8 44.53,46.43 46.3,46.43 U4.2 | ARDUINO_DUE1.6 39.24,51.21 41.73,48.72 41.73,47.81
RX
  Top 0.254: U$2.P$11 95.91,49.09 92.67,49.19 88.65,49.28 80.81,49.28 R4.1
TX  (via drill 0.38)
  Top 0.254: U3.4 66.03,41.92 v66.99,40.96
  Route2 0.254: v66.99,40.96 81.6,40.96 82.87,39.69 84.47,39.13 94.88,39.03 95.53,39.52 98.93,39.52 U$2.P$13

### Text on the board
tNames: U1